# Altium schematic sheet 电击手环.SchDoc
size A3
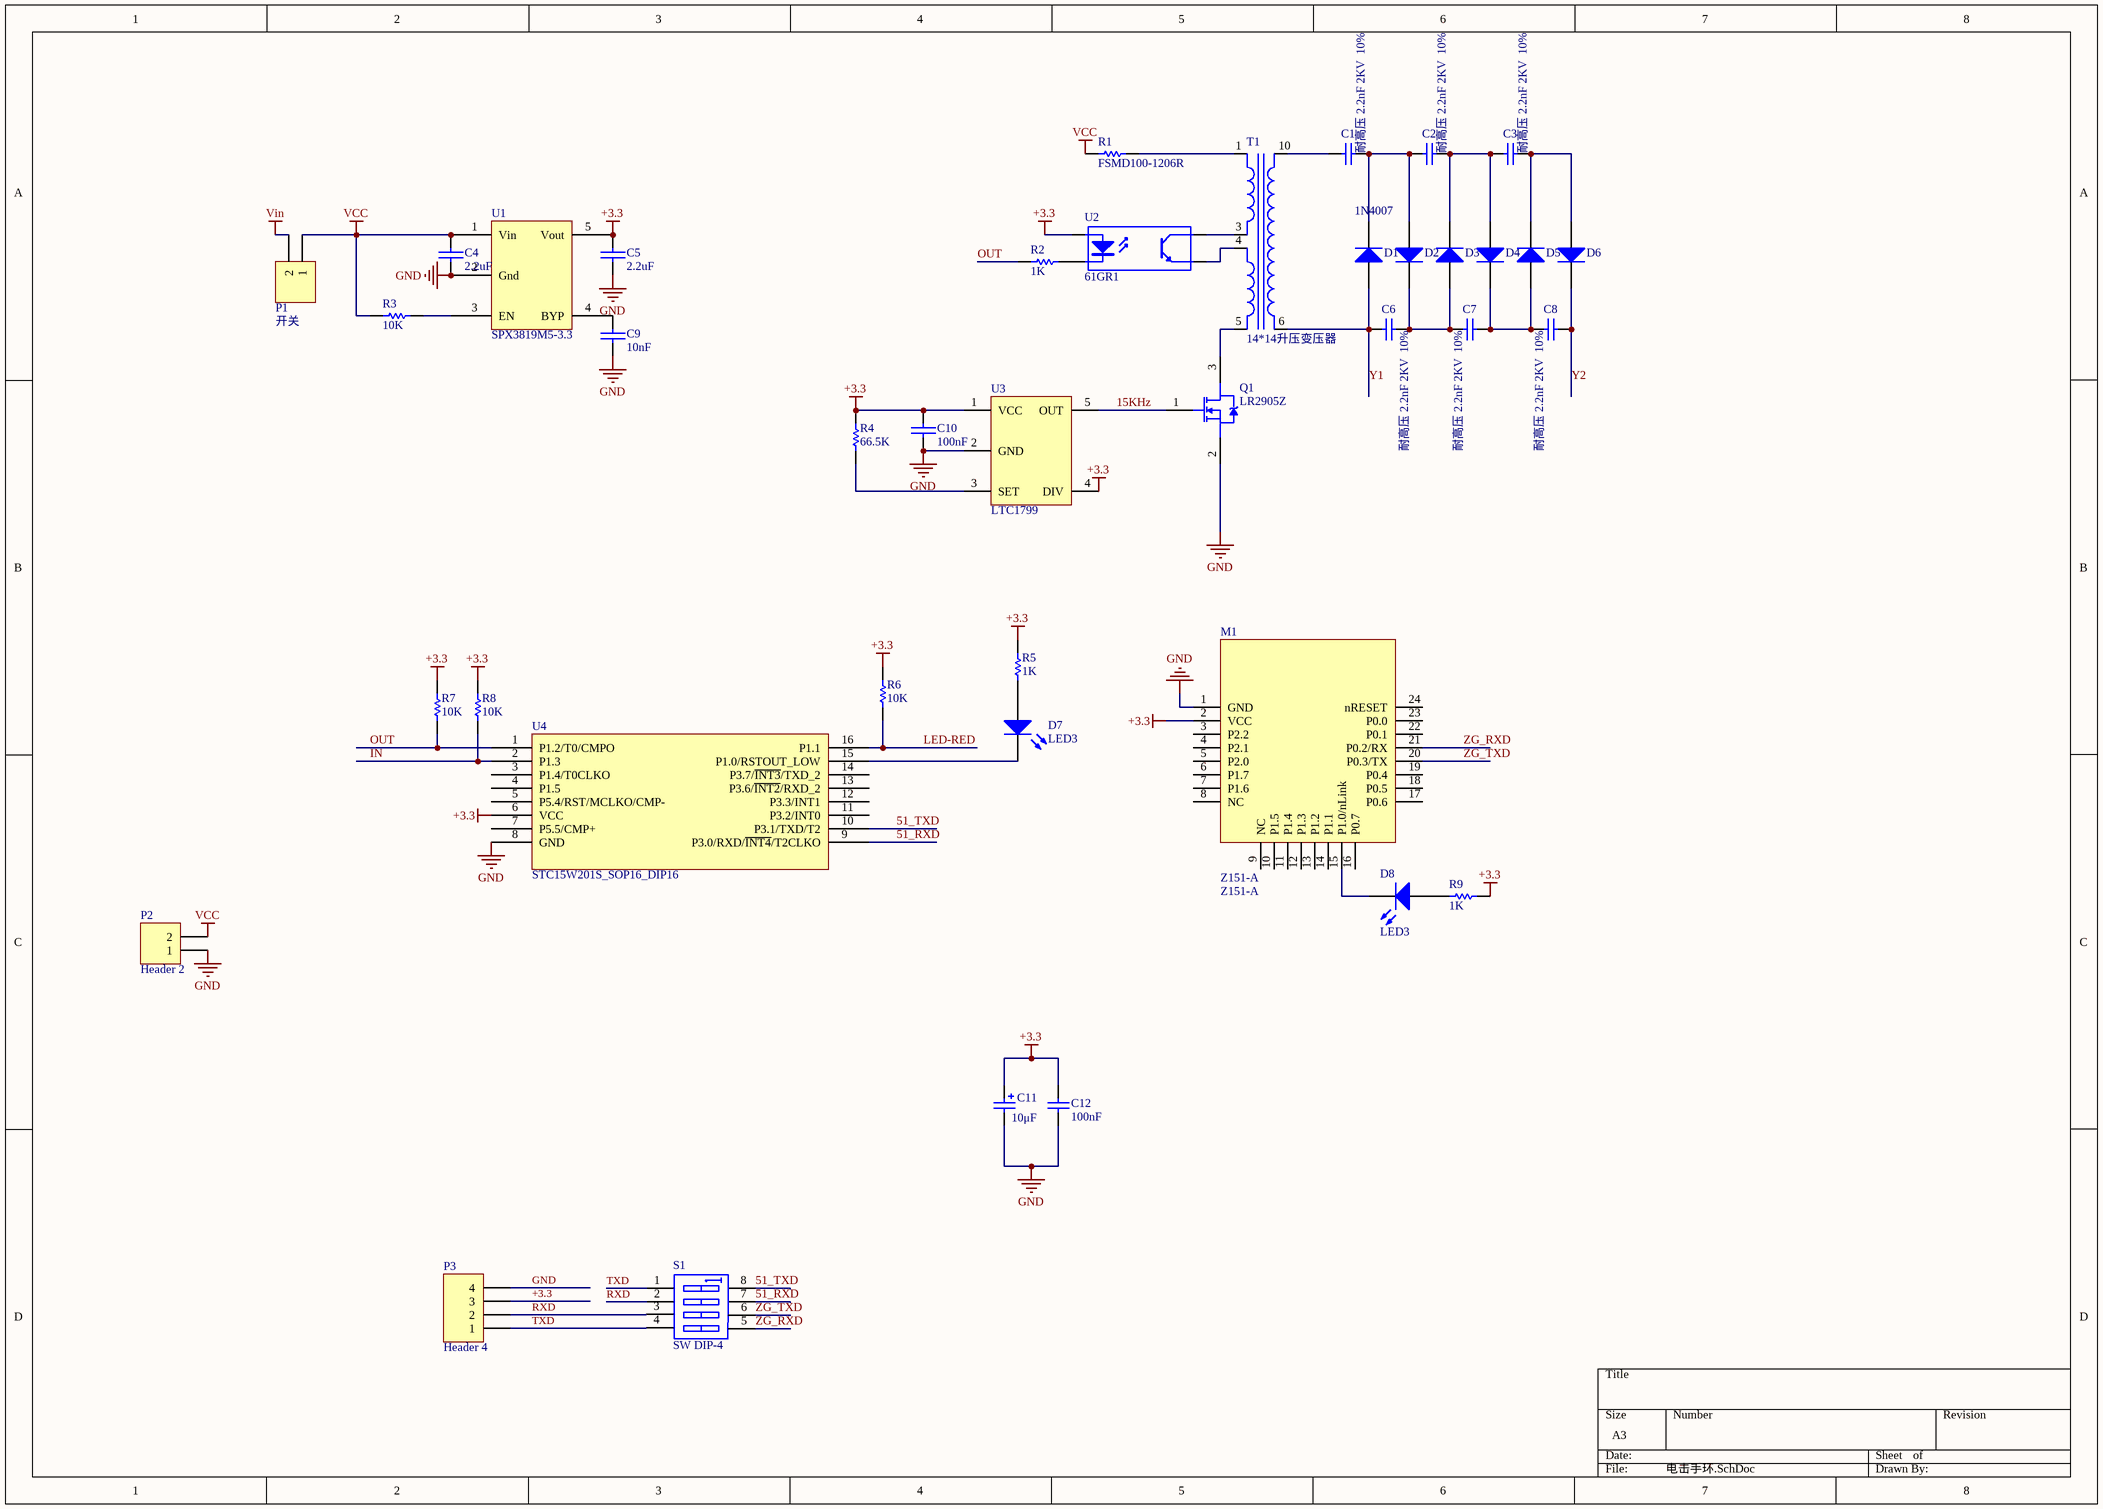
[diagram p0: 电击手环.SchDoc]

## Parts
C1  耐高压 2.2nF 2KV  10%  [1206]
C2  耐高压 2.2nF 2KV  10%  [1206]
C3  耐高压 2.2nF 2KV  10%  [1206]
C4  2.2uF  [0603]
C5  2.2uF  [0603]
C6  耐高压 2.2nF 2KV  10%  [1206]
C7  耐高压 2.2nF 2KV  10%  [1206]
C8  耐高压 2.2nF 2KV  10%  [1206]
C9  10nF  [0603]
C10  100nF  [R0603(1608)]
C11  10μF  [0603]
C12  100nF  [0603]
D1  1N4007  [DO-214AA]
D2  1N4007  [DO-214AA]  (value not drawn)
D3  1N4007  [DO-214AA]  (value not drawn)
D4  1N4007  [DO-214AA]  (value not drawn)
D5  1N4007  [DO-214AA]  (value not drawn)
D6  1N4007  [DO-214AA]  (value not drawn)
D7  LED3  [LED0805]
D8  LED3  [LED0805]
M1  Z151-A  [Z151-A]
P1  开关  [HDR1X2]
P2  Header 2  [HDR1X2]
P3  Header 4  [HDR1X4]
Q1  LR2905Z  [TO-252AA_N]
R1  FSMD100-1206R  [1206]
R2  1K  [R0805(2012)]
R3  10K  [0603]
R4  66.5K  [R0603(1608)]
R5  1K  [0603]
R6  10K  [0603]
R7  10K  [0603]
R8  10K  [0603]
R9  1K  [0603]
S1  SW DIP-4  [拨码开关1.27-5.4-4P]
T1  14*14升压变压器  [14*14 升压变压器]  (mechanical)
U1  SPX3819M5-3.3  [SOT-25]
U2  61GR1  [G3VM]
U3  LTC1799  [SOT-25B]  (mechanical)
U4  STC15W201S_SOP16_DIP16  [SO-16]  (mechanical)

## Nets
+3.3: C5.1 C10.1 C11.1 C12.2 M1.2(VCC) P3.3 R4.1 R5.1 R6.2 R7.2 R8.2 R9.1 U1.5(Vout) U2.1(A) U3.1(VCC) U3.4(DIV) U4.6(VCC)
GND: C4.2 C5.2 C9.2 C10.2 C11.2 C12.1 M1.1(GND) P2.1 P3.4 Q1.2(S1) U1.2(Gnd) U3.2(GND) U4.8(GND)
VCC: C4.1 P1.1 P2.2 R1.1 R3.2 U1.1(Vin)
Vin: P1.2
15KHz: Q1.1(G1) U3.5(OUT)
51_RXD: S1.7 U4.9(P3.0/RXD/~{INT4}/T2CLKO)
51_TXD: S1.8 U4.10(P3.1/TXD/T2)
IN: R8.1 U4.2(P1.3)
LED-RED: R6.1 U4.16(P1.1)
OUT: R2.2 R7.1 U4.1(P1.2/T0/CMPO)
RXD: P3.2 S1.2 S1.3
TXD: P3.1 S1.1 S1.4
Y1: C6.2 D1.1(A) T1.6(Pri+)
Y2: C8.1 D6.2(K)
ZG_RXD: M1.21(P0.2/RX) S1.5
ZG_TXD: M1.20(P0.3/TX) S1.6
NetC1_1: C1.1 C2.2 D1.2(K) D2.1(A)
NetC1_2: C1.2 T1.10(Pri-)
NetC2_1: C2.1 C3.2 D3.2(K) D4.1(A)
NetC3_1: C3.1 D5.2(K) D6.1(A)
NetC6_1: C6.1 C7.2 D2.2(K) D3.1(A)
NetC7_1: C7.1 C8.2 D4.2(K) D5.1(A)
NetC9_1: C9.1 U1.4(BYP)
NetD7_1: D7.1(A) R5.2
NetD7_2: D7.2(K) U4.15(P1.0/RSTOUT_LOW)
NetD8_1: D8.1(A) R9.2
NetD8_2: D8.2(K) M1.15(P1.0/nLink)
NetQ1_3: Q1.3(D1) T1.5(Sec1+)
NetR1_2: R1.2 T1.1(Sec2-)
NetR2_1: R2.1 U2.2(K)
NetR3_1: R3.1 U1.3(EN)
NetR4_2: R4.2 U3.3(SET)
NetT1_3: T1.3(Sec2+) U2.4(C)
NetT1_4: T1.4(Sec1-) U2.3(E)

Not connected (* = marked no-connect by the designer): M1 3(P2.2) 4(P2.1) 5(P2.0) 6(P1.7) 7(P1.6) 8(NC) 9(NC) 10(P1.5) 11(P1.4) 12(P1.3) 13(P1.2) 14(P1.1) 16(P0.7) 17(P0.6) 18(P0.5) 19(P0.4) 22(P0.1) 23(P0.0) 24(nRESET); U4 3(P1.4/T0CLKO) 4(P1.5) 5(P5.4/RST/MCLKO/CMP-) 7(P5.5/CMP+) 11(P3.2/INT0) 12(P3.3/INT1) 13(P3.6/~{INT2}/RXD_2) 14(P3.7/~{INT3}/TXD_2)

## Library data of the parts
C1-C3 C6-C8 C12 = Cap: Capacitor; Published: 8-Jun-2000; LatestRevisionDate: 17-Jul-2002; LatestRevisionNote: Re-released for DXP Platform.; Publisher: Altium Limited
  C12: PackageReference: RAD-0.3; PackageDescription: Radial Cap, Thru-Hole; 2 Leads; 0.3 in Pin Spacing
C4 C5 C9 C10 = CAP: Capacitor
C11 = Cap Pol1: Polarized Capacitor (Radial); Manufacturer: Generic Components; Class: Passive; Published: 08/06/2000; Publisher: Altium Hobart Technology Centre; SubClass: Capacitor
D1-D6 = Diode_1: 二极管; Published: 8-Jun-2000; LatestRevisionDate: 17-Jul-2002; LatestRevisionNote: Re-released for DXP Platform.; PackageDocument: Sep-1996; PackageReference: SMC; Publisher: Altium Limited; Code_JEDEC: DO-214-AB
D7 D8 = LED3: Typical BLUE SiC LED; Published: 8-Jun-2000; LatestRevisionDate: 17-Dec-2003; LatestRevisionNote: PCB Footprint replaced.; DatasheetVersion: 16-Apr-2002; PackageVersion: 16-Apr-2002; PackageReference: 3.5X2.8X1.9; Publisher: Altium Limited; PackageDescription: SM LED; 2 C-Bend Leads; Body 3.5 x 2.8 x 1.9 mm, inc leads (LxWxH typ)
M1 = Z151-A: Z151板载天线版本：Z151-A; Manufacturer: Ghostyu; Part Number: Z151-A; Part Value: Z151-A
P1 P2 = Header 2: Header, 2-Pin; LatestRevisionDate: 17-Jul-2002; LatestRevisionNote: Re-released for DXP Platform.; Publisher: Altium Limited
P3 = Header 4: Header, 4-Pin; LatestRevisionDate: 17-Jul-2002; LatestRevisionNote: Re-released for DXP Platform.; Publisher: Altium Limited
Q1 = MOSFET-N: N-Channel MOSFET; PackageDocument: 1995/1996; Published: 8-Jun-2000; LatestRevisionDate: 17-Jul-2002; LatestRevisionNote: Re-released for DXP Platform.; PackageReference: E3; Publisher: Altium Limited
R1-R9 = Res1: Resistor; Published: 8-Jun-2000; LatestRevisionDate: 17-Jul-2002; LatestRevisionNote: Re-released for DXP Platform.; PackageReference: AXIAL-0.3; Publisher: Altium Limited; PackageDescription: Axial Device, Thru-Hole; 2 Leads; 0.3 in Pin Spacing
S1 = SW DIP-4: DIP Switch, 2 Position, SPST; Published: 24-Mar-1999; LatestRevisionDate: 17-Jul-2002; LatestRevisionNote: Re-released for DXP Platform.; PackageReference: DIP-4; Publisher: Altium Limited
U1 = SP6205: Low Noise, 300mA and 500mA CMOS LDO Regulators
U2 = Optoisolator1: 4-Pin Phototransistor Optocoupler; Published: 24-Mar-1999; LatestRevisionDate: 04-Mar-2005; LatestRevisionNote: Sch pins 3 & 4 Swapped.; DatasheetVersion: Nov-2003; PackageReference: DIP-4; Publisher: Altium Limited